# Altium schematic sheet Cell Monitor V0.1.SchDoc
size A4; SheetNumber: 2; SheetTotal: 5
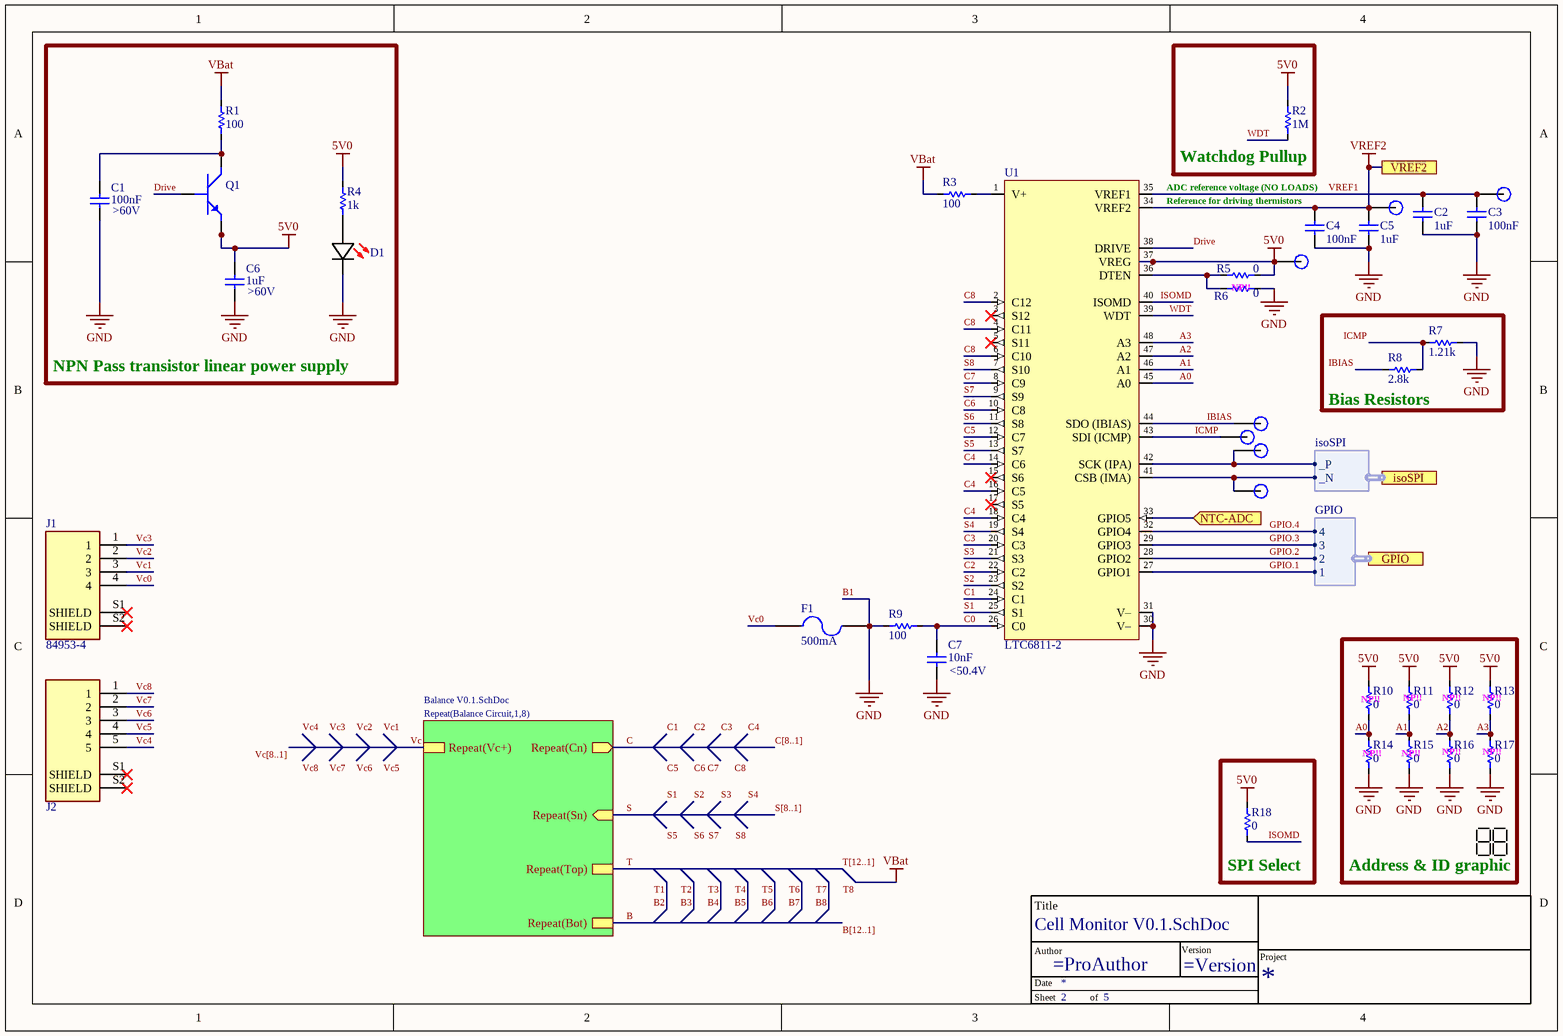
[diagram p0: Cell Monitor V0.1.SchDoc]

## Parts
*?  TitleBlock  (value not drawn)  (graphical)
C1  value 100nF  Voltage: >60V  [C_0603]  (hidden comment: C)
C2  value 1uF  [C-0402]  (hidden comment: C)
C3  value 100nF  [C-0402]  (hidden comment: C)
C4  value 100nF  [C-0402]  (hidden comment: C)
C5  value 1uF  [C-0402]  (hidden comment: C)
C6  value 1uF  Voltage: >60V  [C_0603]  (hidden comment: C)
C7  value 10nF  Voltage: <50.4V  [C_0603]  (hidden comment: C)
D1  150060SS55040  [LED (0603)]  (value not drawn)
F1  Current Rating: 500mA  [0466.500NR]  (hidden comment: 0466.500NR)
J1  84953-4  [84953-4]
J2  84953-5  [84953-5]  (value not drawn)
NT1  NetTie  [NetTie]  (value not drawn)  (net tie, no BOM)
NT2  NetTie  [NetTie]  (value not drawn)  (net tie, no BOM)
Q1  PHPT60603NYX  [LFPAK56 (SOT669)]  (value not drawn)
R1  value 100  [R_2010]  (hidden comment: Resistor)
R2  value 1M  [R_0402]  (hidden comment: Resistor)
R3  value 100  [R_2010]  (hidden comment: Resistor)
R4  value 1k  [R-0603]  (hidden comment: Resistor)
R5  value 0  [R_0402]  (hidden comment: Resistor)
R6  value 0  [R_0402]  (hidden comment: Resistor)
R7  value 1.21k  [R_0402]  (hidden comment: Resistor)
R8  value 2.8k  [R_0402]  (hidden comment: Resistor)
R9  value 100  [R-0603]  (hidden comment: Resistor)
R10  value 0  [R_0402]  (hidden comment: Resistor)
R11  value 0  [R_0402]  (hidden comment: Resistor)
R12  value 0  [R_0402]  (hidden comment: Resistor)
R13  value 0  [R_0402]  (hidden comment: Resistor)
R14  value 0  [R_0402]  (hidden comment: Resistor)
R15  value 0  [R_0402]  (hidden comment: Resistor)
R16  value 0  [R_0402]  (hidden comment: Resistor)
R17  value 0  [R_0402]  (hidden comment: Resistor)
R18  value 0  [R_0402]  (hidden comment: Resistor)
S1  2x7Segment  [2x7Segment]  (value not drawn)  (no BOM)
TP1  VREF1  [Test Point]  (value not drawn)  (no BOM)
TP2  VREF2  [Test Point]  (value not drawn)  (no BOM)
TP3  5V0  [Test Point]  (value not drawn)  (no BOM)
TP4  IBIAS  [Test Point]  (value not drawn)  (no BOM)
TP5  ICMP  [Test Point]  (value not drawn)  (no BOM)
TP6  IPA  [Test Point]  (value not drawn)  (no BOM)
TP7  IMA  [Test Point]  (value not drawn)  (no BOM)
U1  LTC6811-2  [SSOP50P780X200-48N]

## Blocks framed on the sheet
NPN Pass transistor linear power supply: C1 C6 D1 Q1 R1 R4
Watchdog Pullup: R2
Bias Resistors: R7 R8
Address & ID graphic: R10-R17 S1
SPI Select: R18

## Sub-sheets
Repeat(Balance Circuit,1,8) = Balance V0.1.SchDoc: Repeat(Bot), Repeat(Vc+), Repeat(Top), Repeat(Cn) (out), Repeat(Sn) (in)

## Ports
GPIO (harness GPIO), isoSPI (harness isoSPI), NTC-ADC (in), VREF2

## Harnesses
GPIO: 1, 2, 3, 4
isoSPI: _P, _N

## Nets
5V0: C6.2 Q1.1(Emitter) Q1.2(Emitter) Q1.3(Emitter) R2.2 R4.2 R5.2 R10.2 R11.2 R12.2 R13.2 R18.2 TP3.1 U1.37(VREG)
GND: C1.1 C2.1 C3.1 C4.1 C5.1 C6.1 C7.1 D1.1(K) F1.2 NT1.1 R6.1 R7.2 R9.1 R14.1 R15.1 R16.1 R17.1 U1.30(V–) U1.31(V–)
VBat: NT2.2 R1.2 R3.2
VREF2: C4.2 C5.2 TP2.1 U1.34(VREF2) ; port VREF2
A0: R10.1 R14.2 U1.45(A0)
A1: R11.1 R15.2 U1.46(A1)
A2: R12.1 R16.2 U1.47(A2)
A3: R13.1 R17.2 U1.48(A3)
B: sheet Repeat(Balance Circuit,1,8)/Repeat(Bot)
B1: NT1.2
C: sheet Repeat(Balance Circuit,1,8)/Repeat(Cn)
C0: C7.2 R9.2 U1.26(C0)
C1: U1.24(C1)
C2: U1.22(C2)
C3: U1.20(C3)
C4: U1.14(C6) U1.16(C5) U1.18(C4)
C5: U1.12(C7)
C6: U1.10(C8)
C7: U1.8(C9)
C8: U1.2(C12) U1.4(C11) U1.6(C10)
Drive: Q1.4(Base) U1.38(DRIVE)
GPIO.1: U1.27(GPIO1) ; port GPIO.1
GPIO.2: U1.28(GPIO2) ; port GPIO.2
GPIO.3: U1.29(GPIO3) ; port GPIO.3
GPIO.4: U1.32(GPIO4) ; port GPIO.4
IBIAS: R8.1 TP4.1 U1.44(SDO_(IBIAS))
ICMP: R7.1 R8.2 TP5.1 U1.43(SDI_(ICMP))
ISOMD: R18.1 U1.40(ISOMD)
NTC-ADC: U1.33(GPIO5) ; port NTC-ADC
S: sheet Repeat(Balance Circuit,1,8)/Repeat(Sn)
S1: U1.25(S1)
S2: U1.23(S2)
S3: U1.21(S3)
S4: U1.19(S4)
S5: U1.13(S7)
S6: U1.11(S8)
S7: U1.9(S9)
S8: U1.7(S10)
T: sheet Repeat(Balance Circuit,1,8)/Repeat(Top)
T8: NT2.1
Vc: sheet Repeat(Balance Circuit,1,8)/Repeat(Vc+)
Vc0: F1.1 J1.4
Vc1: J1.3
Vc2: J1.2
Vc3: J1.1
Vc4: J2.5
Vc5: J2.4
Vc6: J2.3
Vc7: J2.2
Vc8: J2.1
VREF1: C2.2 C3.2 TP1.1 U1.35(VREF1)
WDT: R2.1 U1.39(WDT)
NetC1_2: C1.2 Q1.5(Collector) R1.1
NetD1_2: D1.2(A) R4.1
NetR3_1: R3.1 U1.1(V+)
NetR5_1: R5.1 R6.2 U1.36(DTEN)
NetTP6_1: TP6.1 U1.42(SCK_(IPA)) ; port isoSPI._P
NetTP7_1: TP7.1 U1.41(CSB_(IMA)) ; port isoSPI._N

Not connected (* = marked no-connect by the designer): J1 S1(SHIELD)* S2(SHIELD)*; J2 S1(SHIELD)* S2(SHIELD)*; U1 3(S12)* 5(S11)* 15(S6)* 17(S5)*

## Buses and harness runs
bus B[12..1]
bus C[8..1]
bus S[8..1]
bus T[12..1]
bus Vc[8..1]

## Notes on the sheet
- ADC reference voltage (NO LOADS)
- (near C4) Reference for driving thermistors
- (near R6) NP!!
- (near R10) NP!!
- (near R11) NP!!
- (near R12) NP!!
- (near R13) NP!!
- (near R14) NP!!
- (near R15) NP!!
- (near R16) NP!!
- (near R17) NP!!
- Labels drawn without touching a wire or pin: C1, C2, C3, C4, C5, C6, C7, C8, S1, S2, S3, S4, S5, S6, S7, S8, Vc1, Vc2, Vc3, Vc4, Vc5, Vc6, Vc7, Vc8
- (in symbol TitleBlock) Title; Author; Version; Project; Date; Sheet; of

## Library data of the parts
C1-C7 = Capacitor: ComponentLink1Description: New link; ComponentLink1URL: *
D1 = 150060SS55040: LED RED DIFFUSED 0603 SMD; Manufacturer: Wurth Electronics; Lens Style: Flat; Luminous Intensity: 70mcd; Forward Voltage: 2V; Test Current: 20mA; Viewing Angle: 140°; Dominant Wavelength: 630nm; Lens Size: 0.8mm; Supplier 1: Mouser; Manufacturer Part Number: 150060SS55040; RoHS: No; Category: LEDs; Stock 1: 17006; Pricing 1: 1=0.18000, 10=0.16800, 50=0.16800, 100=0.15200, 1000=0.12100, 10000=0.10600 (USD); Mount: Surface Mount; Case/Package: 0603; Color: Red; Case Code (Imperial): 0603; Case Code (Metric): 1608; Packaging: Tape and Reel; Lens Transparency: Diffused; Length: 1.6mm; Width: 0.8mm; Height: 0.5mm; RoHS Compliant: No; Supplier Part Number 1: 710-150060SS55040
F1 = Fuse 2: LITTELFUSE - 0466.500NR - Fuse, Surface Mount, 500 mA, 466 Series, 63 VAC, 63 VDC, Very Fast Acting, 1206; Body Material: Thermoplastic; Voltage Rating (AC): 63V; Resistance: 350mR; DC Cold Resistance: 248mR; Fuse Type: Board Mount (Cartridge Style Excluded); Approvals: UL,CSA; Published: 8-Jun-2000; LatestRevisionDate: 17-Jul-2002; LatestRevisionNote: Re-released for DXP Platform.; PackageReference: PIN-W2/E2.8; Publisher: Altium Limited; PackageDescription: Thru-Hole; 2 Leads; Supplier 1: Mouser; Supplier Part Number 1: 576-0466.500NR; Manufacturer: Littelfuse; Manufacturer Part Number: 0466.500NR; RoHS: Yes; Category: Fuses; Stock 1: 36497; Pricing 1: 1=0.77000, 10=0.59200, 50=0.59200, 100=0.48900, 1000=0.41600, 10000=0.39000 (USD); Mount: Surface Mount; Case/Package: 1206; Number of Pins: 2; Case Code (Metric): 3216; Case Code (Imperial): 1206; Housing Material: Ceramic; Terminal Material: Copper; Min Operating Temperature: -55°C; Max Operating Temperature: 90°C; Packaging: Tape and Reel; Package Quantity: 5000; Voltage Rating (DC): 63V; Series: 466; Voltage Rating: 63V; Termination: SMD/SMT; Fuse Current: 500mA; Working Voltage: 63V; Length: 3.18mm; Width: 0.06inch; Height: 0.023inch; Depth: 1.52mm; Radiation Hardening: No; RoHS Compliant: Yes; REACH SVHC: Unknown; Lead Free: Lead Free; ComponentLink1URL: https://datasheet.ciiva.com/17081/0466-500nr-17081083.pdf?src-supplier=Allied+Electronics; ComponentLink1Description: https://datasheet.ciiva.com/17081/0466-500nr-17081083.pdf?src-supplier=Allied+Electronics; ComponentLink2URL: https://datasheet.ciiva.com/16327/littelfuse-fuse-466-16327478.pdf?src-supplier=Future+Electronics; ComponentLink2Description: https://datasheet.ciiva.com/16327/littelfuse-fuse-466-16327478.pdf?src-supplier=Future+Electronics; ComponentLink3URL: https://datasheet.ciiva.com/299/466seriesdrawing-299207.pdf?src-supplier=Digi-Key; ComponentLink3Description: https://datasheet.ciiva.com/299/466seriesdrawing-299207.pdf?src-supplier=Digi-Key; ComponentLink4URL: https://datasheet.ciiva.com/299/466seriesdrawing-299208.pdf?src-supplier=Digi-Key; ComponentLink4Description: https://datasheet.ciiva.com/299/466seriesdrawing-299208.pdf?src-supplier=Digi-Key; ComponentLink5URL: https://datasheet.ciiva.com/299/466seriesdrawing-299209.pdf?src-supplier=Digi-Key; ComponentLink5Description: https://datasheet.ciiva.com/299/466seriesdrawing-299209.pdf?src-supplier=Digi-Key; ComponentLink6URL: https://datasheet.ciiva.com/14102/ei466-dat-e-14102891.pdf?src-supplier=Distrelec; ComponentLink6Description: https://datasheet.ciiva.com/14102/ei466-dat-e-14102891.pdf?src-supplier=Distrelec; ComponentLink7URL: https://datasheet.ciiva.com/15186/getdatasheetpartid-57351-15186924.pdf?src-supplier=Verical; ComponentLink7Description: https://datasheet.ciiva.com/15186/getdatasheetpartid-57351-15186924.pdf?src-supplier=Verical
J1 = 84953-4: FPC Connectors, Flex-to-Board, 4 Position, .039 in [1 mm] Centerline, Zero Insertion Force (ZIF), Right Angle, Surface Mount; MF: {'manufacturer': u'TE Connectivity'}; Value: *; Availability: Unavailable; Package: None; MP: 84953-4; Price: None
J2 = 84953-5: FPC Connectors, Flex-to-Board, 5 Position, .039 in [1 mm] Centerline, Zero Insertion Force (ZIF), Right Angle, Surface Mount.
Q1 = PHPT60603NYX: 60V, 3 A NPN high power bipolar transistor
TP1-TP7 = Test Point: 1.2mm Test point
U1 = LTC6811-2: 12 Channel Multicell Battery Monitor with Addressable Interface